# Altium schematic sheet SD Card Reader.SchDoc
size A; SheetNumber: 7; SheetTotal: 7
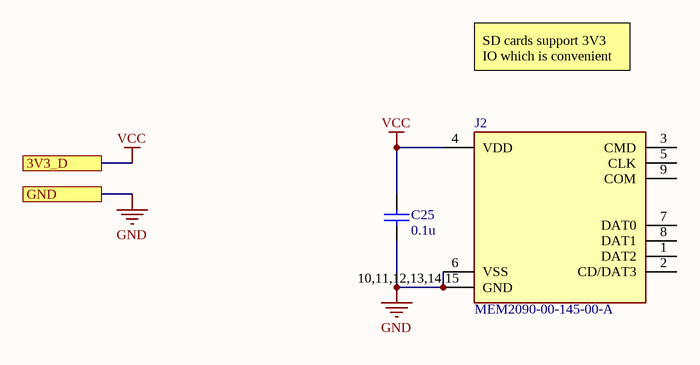
[diagram p0: SD Card Reader.SchDoc]

## Parts
C25  value 0.1u  (hidden comment: Capacitor)
J2  MEM2090-00-145-00-A  [MEM20900014500A]

## Ports
3V3_D, GND

## Nets
GND: C25.1 J2.6(VSS) J2.10,11,12,13,14,15(GND) ; port GND
VCC: C25.2 J2.4(VDD) ; port 3V3_D

Not connected (* = marked no-connect by the designer): J2 1(DAT2) 2(CD/DAT3) 3(CMD) 5(CLK) 7(DAT0) 8(DAT1) 9(COM)

## Notes on the sheet
- SD cards support 3V3 IO which is convenient

## Library data of the parts
C25 = Capacitor: SimulationGenericComponent: True
J2 = MEM2090-00-145-00-A: Memory Card Connectors Micro SD Push-Push, Normaly Open, SMT, 1.45mm Profile, No Peg; Manufacturer_Name: GCT (GLOBAL CONNECTOR TECHNOLOGY); Geometry.Height: 1.6mm; Mouser Part Number: 640-MEM20900014500A; Mouser Price/Stock: https://www.mouser.co.uk/ProductDetail/GCT/MEM2090-00-145-00-A?qs=jRuttqqUwMR0RI4XLNZI4Q%3D%3D; Manufacturer_Part_Number: MEM2090-00-145-00-A; Datasheet Link: https://www.mouser.at/datasheet/2/837/mem2090-3435332.pdf